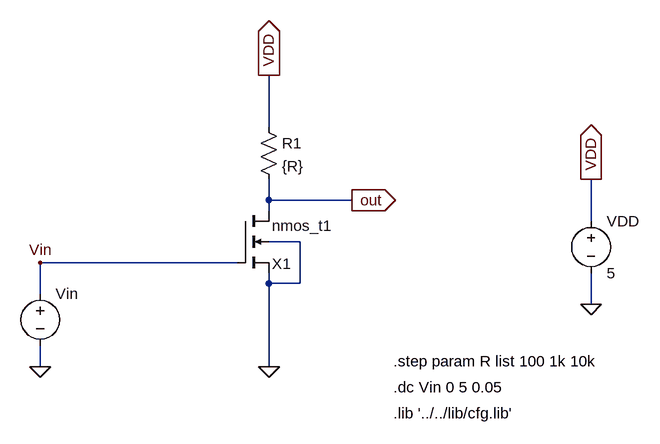
[diagram p0: schematic nmos-rtl[dc].asc]
nmos-rtl[dc].asc, the LTspice schematic file:
Version 4
SHEET 1 1144 680
WIRE 336 32 336 -48
WIRE 336 144 336 112
WIRE 464 144 336 144
WIRE 336 160 336 144
WIRE 832 176 832 112
WIRE 384 208 336 208
WIRE 288 240 -16 240
WIRE 336 272 336 256
WIRE 384 272 384 208
WIRE 384 272 336 272
WIRE -16 288 -16 240
WIRE 832 304 832 256
WIRE -16 400 -16 368
WIRE 336 400 336 272
FLAG 336 400 0
FLAG -16 400 0
FLAG 464 144 out
IOPIN 464 144 Out
FLAG 832 304 0
FLAG 832 112 VDD
IOPIN 832 112 Out
FLAG 336 -48 VDD
IOPIN 336 -48 Out
FLAG -16 240 Vin
SYMBOL res 320 16 R0
SYMATTR InstName R1
SYMATTR Value {R}
SYMBOL voltage -16 272 R0
WINDOW 123 0 0 Left 2
WINDOW 39 0 0 Left 2
SYMATTR InstName Vin
SYMATTR Value ""
SYMBOL voltage 832 160 R0
SYMATTR InstName VDD
SYMATTR Value 5
SYMBOL nmos4 288 160 R0
WINDOW 0 53 82 Left 2
WINDOW 3 53 23 Left 2
SYMATTR InstName X1
SYMATTR Value nmos_t1
SYMATTR Prefix X
TEXT 528 472 Left 2 !.lib '../../lib/cfg.lib'
TEXT 528 432 Left 2 !.dc Vin 0 5 0.05
TEXT 528 392 Left 2 !.step param R list 100 1k 10k

The netlist it stands for:
* nmos-rtl[dc].asc
R1 VDD out {R}
Vin Vin 0
VDD VDD 0 5
XX1 out Vin 0 0 nmos_t1  ; pins D G S B
.lib '../../lib/cfg.lib'
.dc Vin 0 5 0.05
.step param R list 100 1k 10k
.backanno
.end